# EAGLE design PGTN022_euclidean_logic (EAGLE 9.6.0)
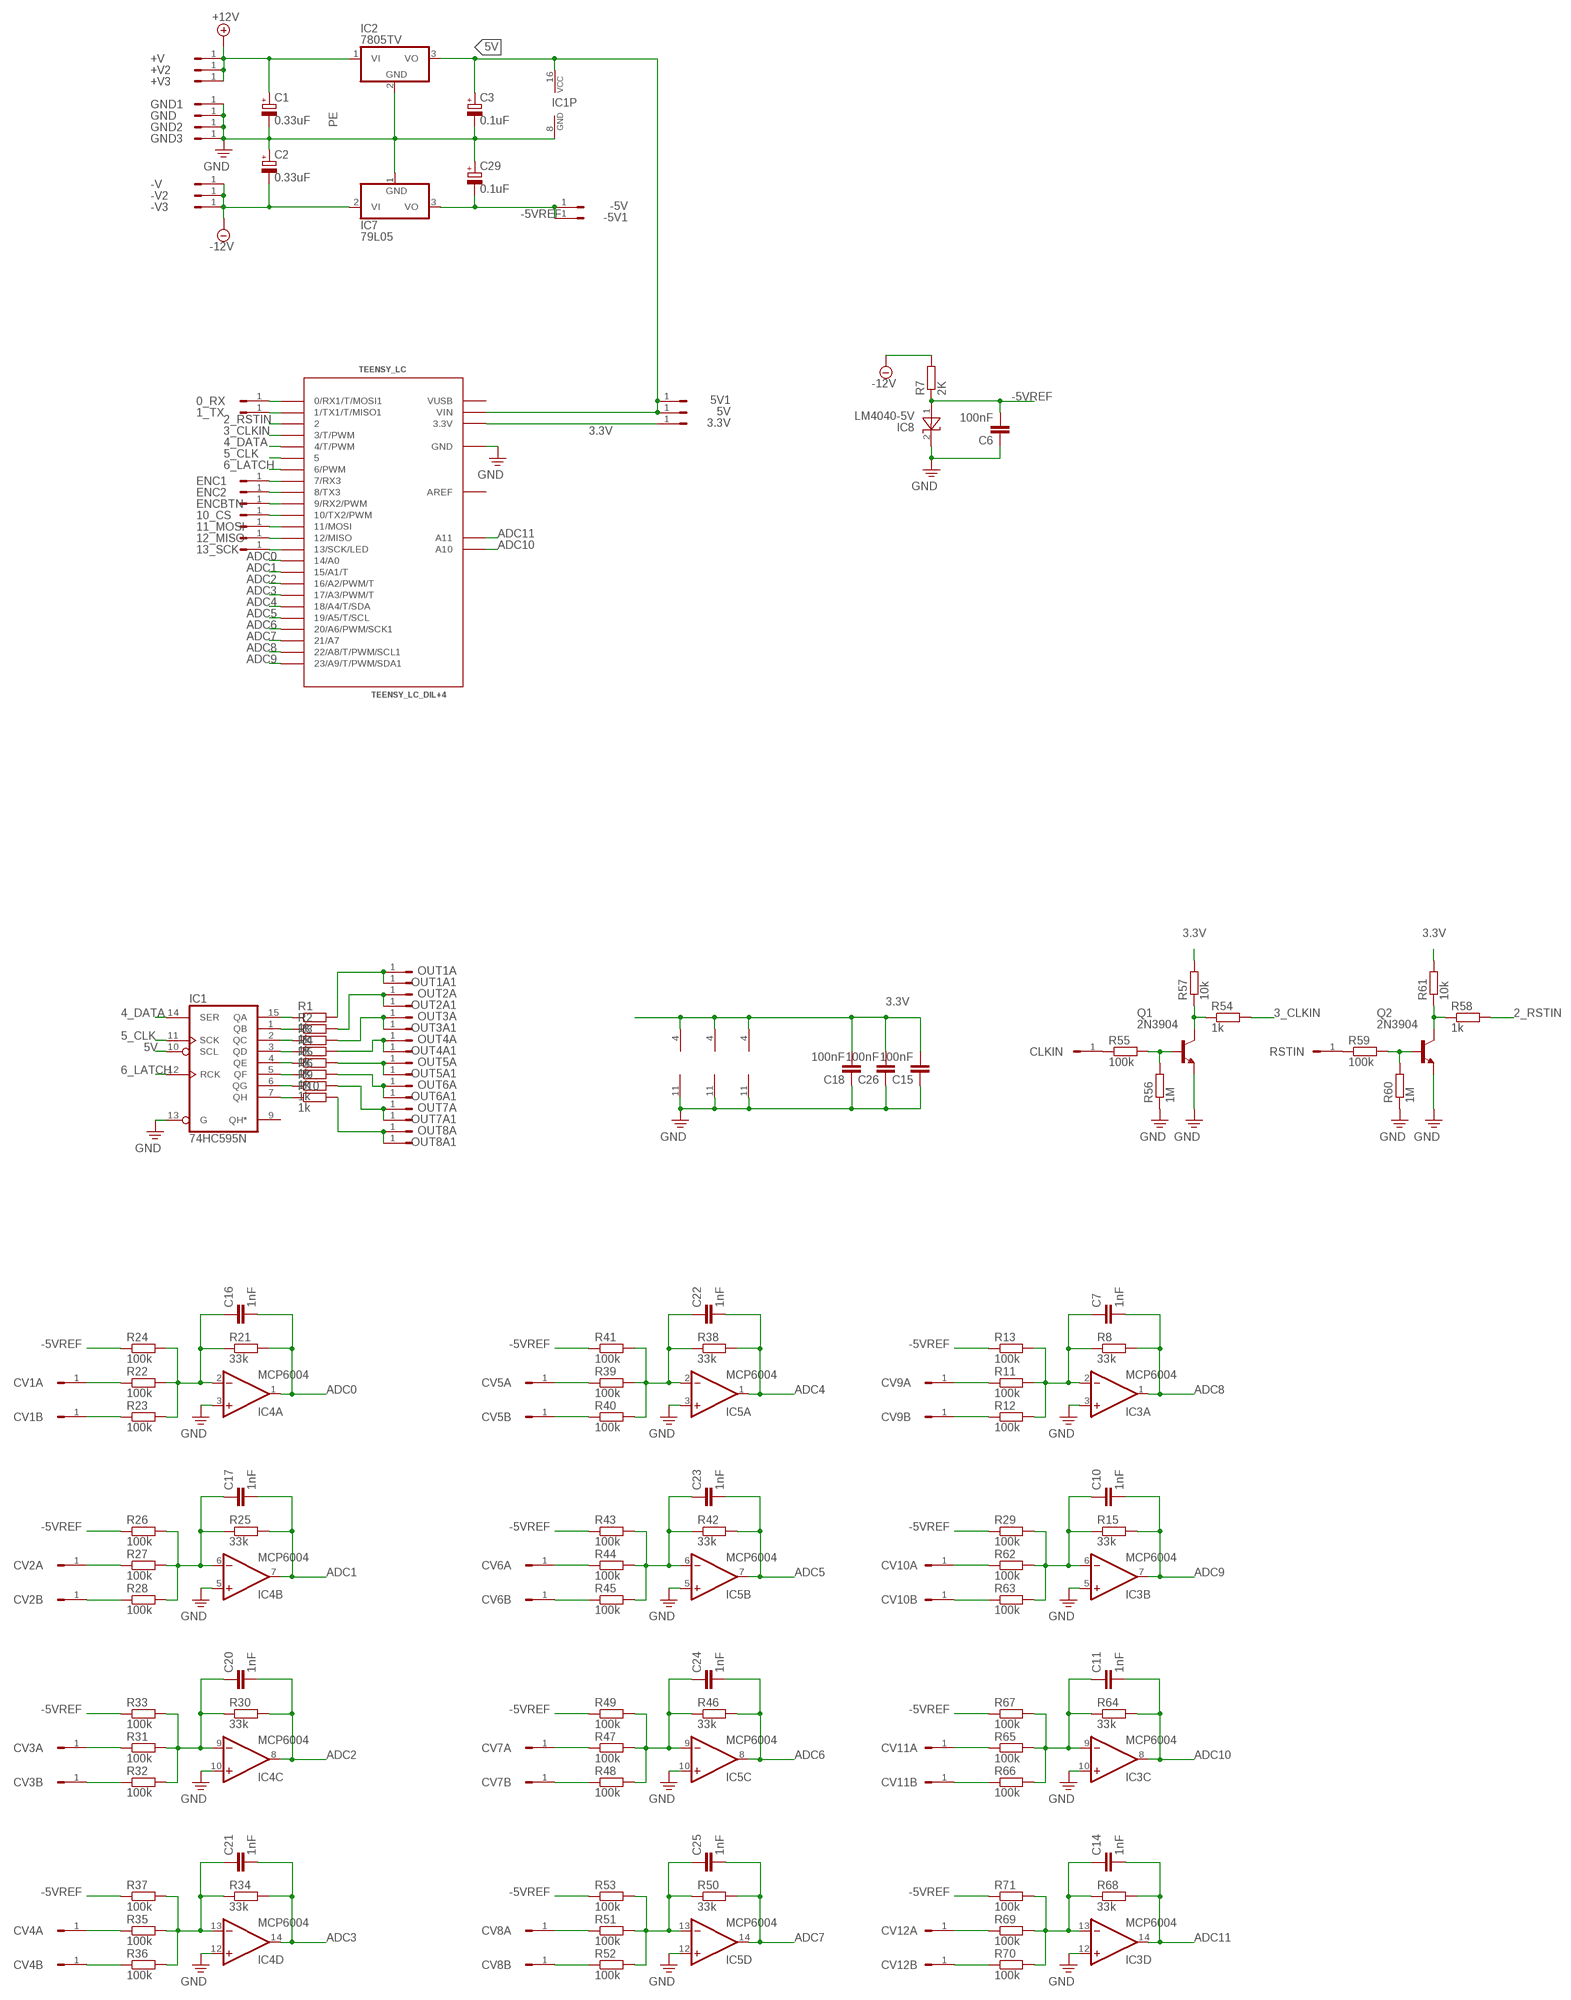
[diagram p0: schematic, sheet 1]

## Parts
0_RX  HEADER/MALE/01  [HEADER/MALE/01]
1_TX  HEADER/MALE/01  [HEADER/MALE/01]
3.3V  HEADER/MALE/01  [HEADER/MALE/01]
5V  HEADER/MALE/01  [HEADER/MALE/01]
5V1  HEADER/MALE/01  [HEADER/MALE/01]
10_CS  HEADER/MALE/01  [HEADER/MALE/01]
11_MOSI  HEADER/MALE/01  [HEADER/MALE/01]
12_MISO  HEADER/MALE/01  [HEADER/MALE/01]
13_SCK  HEADER/MALE/01  [HEADER/MALE/01]
+V  HEADER/MALE/01  [HEADER/MALE/01]
+V2  HEADER/MALE/01  [HEADER/MALE/01]
+V3  HEADER/MALE/01  [HEADER/MALE/01]
-5V  HEADER/MALE/01  [HEADER/MALE/01]
-5V1  HEADER/MALE/01  [HEADER/MALE/01]
-V  HEADER/MALE/01  [HEADER/MALE/01]
-V2  HEADER/MALE/01  [HEADER/MALE/01]
-V3  HEADER/MALE/01  [HEADER/MALE/01]
C1  0.33uF  CAPACITOR/POLARIZEDE2.5-6  [E2,5-6]
C2  0.33uF  CAPACITOR/POLARIZEDE2.5-6  [E2,5-6]
C3  0.1uF  CAPACITOR/POLARIZEDE2.5-6  [E2,5-6]
C6  100nF  CAPACITORCERAMICDISC/5  [CERAMICDISC/5]
C7  1nF  CAPACITORCERAMICDISC/5  [CERAMICDISC/5]
C10  1nF  CAPACITORCERAMICDISC/5  [CERAMICDISC/5]
C11  1nF  CAPACITORCERAMICDISC/5  [CERAMICDISC/5]
C14  1nF  CAPACITORCERAMICDISC/5  [CERAMICDISC/5]
C15  100nF  CAPACITORCERAMICDISC/5  [CERAMICDISC/5]
C16  1nF  CAPACITORCERAMICDISC/5  [CERAMICDISC/5]
C17  1nF  CAPACITORCERAMICDISC/5  [CERAMICDISC/5]
C18  100nF  CAPACITORCERAMICDISC/5  [CERAMICDISC/5]
C20  1nF  CAPACITORCERAMICDISC/5  [CERAMICDISC/5]
C21  1nF  CAPACITORCERAMICDISC/5  [CERAMICDISC/5]
C22  1nF  CAPACITORCERAMICDISC/5  [CERAMICDISC/5]
C23  1nF  CAPACITORCERAMICDISC/5  [CERAMICDISC/5]
C24  1nF  CAPACITORCERAMICDISC/5  [CERAMICDISC/5]
C25  1nF  CAPACITORCERAMICDISC/5  [CERAMICDISC/5]
C26  100nF  CAPACITORCERAMICDISC/5  [CERAMICDISC/5]
C29  0.1uF  CAPACITOR/POLARIZEDE2.5-6  [E2,5-6]
CLKIN  HEADER/MALE/01  [HEADER/MALE/01]
CV1A  HEADER/MALE/01  [HEADER/MALE/01]
CV1B  HEADER/MALE/01  [HEADER/MALE/01]
CV2A  HEADER/MALE/01  [HEADER/MALE/01]
CV2B  HEADER/MALE/01  [HEADER/MALE/01]
CV3A  HEADER/MALE/01  [HEADER/MALE/01]
CV3B  HEADER/MALE/01  [HEADER/MALE/01]
CV4A  HEADER/MALE/01  [HEADER/MALE/01]
CV4B  HEADER/MALE/01  [HEADER/MALE/01]
CV5A  HEADER/MALE/01  [HEADER/MALE/01]
CV5B  HEADER/MALE/01  [HEADER/MALE/01]
CV6A  HEADER/MALE/01  [HEADER/MALE/01]
CV6B  HEADER/MALE/01  [HEADER/MALE/01]
CV7A  HEADER/MALE/01  [HEADER/MALE/01]
CV7B  HEADER/MALE/01  [HEADER/MALE/01]
CV8A  HEADER/MALE/01  [HEADER/MALE/01]
CV8B  HEADER/MALE/01  [HEADER/MALE/01]
CV9A  HEADER/MALE/01  [HEADER/MALE/01]
CV9B  HEADER/MALE/01  [HEADER/MALE/01]
CV10A  HEADER/MALE/01  [HEADER/MALE/01]
CV10B  HEADER/MALE/01  [HEADER/MALE/01]
CV11A  HEADER/MALE/01  [HEADER/MALE/01]
CV11B  HEADER/MALE/01  [HEADER/MALE/01]
CV12A  HEADER/MALE/01  [HEADER/MALE/01]
CV12B  HEADER/MALE/01  [HEADER/MALE/01]
ENC1  HEADER/MALE/01  [HEADER/MALE/01]
ENC2  HEADER/MALE/01  [HEADER/MALE/01]
ENCBTN  HEADER/MALE/01  [HEADER/MALE/01]
GND  HEADER/MALE/01  [HEADER/MALE/01]
GND1  HEADER/MALE/01  [HEADER/MALE/01]
GND2  HEADER/MALE/01  [HEADER/MALE/01]
GND3  HEADER/MALE/01  [HEADER/MALE/01]
IC1  74HC595N  [DIL16]
IC2  7805TV  [TO220V]
IC3  MCP6004  TL074P  [DIL14]
IC4  MCP6004  TL074P  [DIL14]
IC5  MCP6004  TL074P  [DIL14]
IC7  79L05  79L05Z  [TO92]
IC8  LM4040-5V  LM4040  [TO92]
OUT1A  HEADER/MALE/01  [HEADER/MALE/01]
OUT1A1  HEADER/MALE/01  [HEADER/MALE/01]
OUT2A  HEADER/MALE/01  [HEADER/MALE/01]
OUT2A1  HEADER/MALE/01  [HEADER/MALE/01]
OUT3A  HEADER/MALE/01  [HEADER/MALE/01]
OUT3A1  HEADER/MALE/01  [HEADER/MALE/01]
OUT4A  HEADER/MALE/01  [HEADER/MALE/01]
OUT4A1  HEADER/MALE/01  [HEADER/MALE/01]
OUT5A  HEADER/MALE/01  [HEADER/MALE/01]
OUT5A1  HEADER/MALE/01  [HEADER/MALE/01]
OUT6A  HEADER/MALE/01  [HEADER/MALE/01]
OUT6A1  HEADER/MALE/01  [HEADER/MALE/01]
OUT7A  HEADER/MALE/01  [HEADER/MALE/01]
OUT7A1  HEADER/MALE/01  [HEADER/MALE/01]
OUT8A  HEADER/MALE/01  [HEADER/MALE/01]
OUT8A1  HEADER/MALE/01  [HEADER/MALE/01]
Q1  2N3904  [TO92]
Q2  2N3904  [TO92]
R1  1k  RESISTORRESISTOR/UPRIGHT/7.5  [RESISTOR/7.5]
R2  1k  RESISTORRESISTOR/UPRIGHT/7.5  [RESISTOR/7.5]
R3  1k  RESISTORRESISTOR/UPRIGHT/7.5  [RESISTOR/7.5]
R4  1k  RESISTORRESISTOR/UPRIGHT/7.5  [RESISTOR/7.5]
R5  1k  RESISTORRESISTOR/UPRIGHT/7.5  [RESISTOR/7.5]
R6  1k  RESISTORRESISTOR/UPRIGHT/7.5  [RESISTOR/7.5]
R7  2K  RESISTORRESISTOR/UPRIGHT/7.5  [RESISTOR/7.5]
R8  33k  RESISTORRESISTOR/UPRIGHT/7.5  [RESISTOR/7.5]
R9  1k  RESISTORRESISTOR/UPRIGHT/7.5  [RESISTOR/7.5]
R10  1k  RESISTORRESISTOR/UPRIGHT/7.5  [RESISTOR/7.5]
R11  100k  RESISTORRESISTOR/UPRIGHT/7.5  [RESISTOR/7.5]
R12  100k  RESISTORRESISTOR/UPRIGHT/7.5  [RESISTOR/7.5]
R13  100k  RESISTORRESISTOR/UPRIGHT/7.5  [RESISTOR/7.5]
R15  33k  RESISTORRESISTOR/UPRIGHT/7.5  [RESISTOR/7.5]
R21  33k  RESISTORRESISTOR/UPRIGHT/7.5  [RESISTOR/7.5]
R22  100k  RESISTORRESISTOR/UPRIGHT/7.5  [RESISTOR/7.5]
R23  100k  RESISTORRESISTOR/UPRIGHT/7.5  [RESISTOR/7.5]
R24  100k  RESISTORRESISTOR/UPRIGHT/7.5  [RESISTOR/7.5]
R25  33k  RESISTORRESISTOR/UPRIGHT/7.5  [RESISTOR/7.5]
R26  100k  RESISTORRESISTOR/UPRIGHT/7.5  [RESISTOR/7.5]
R27  100k  RESISTORRESISTOR/UPRIGHT/7.5  [RESISTOR/7.5]
R28  100k  RESISTORRESISTOR/UPRIGHT/7.5  [RESISTOR/7.5]
R29  100k  RESISTORRESISTOR/UPRIGHT/7.5  [RESISTOR/7.5]
R30  33k  RESISTORRESISTOR/UPRIGHT/7.5  [RESISTOR/7.5]
R31  100k  RESISTORRESISTOR/UPRIGHT/7.5  [RESISTOR/7.5]
R32  100k  RESISTORRESISTOR/UPRIGHT/7.5  [RESISTOR/7.5]
R33  100k  RESISTORRESISTOR/UPRIGHT/7.5  [RESISTOR/7.5]
R34  33k  RESISTORRESISTOR/UPRIGHT/7.5  [RESISTOR/7.5]
R35  100k  RESISTORRESISTOR/UPRIGHT/7.5  [RESISTOR/7.5]
R36  100k  RESISTORRESISTOR/UPRIGHT/7.5  [RESISTOR/7.5]
R37  100k  RESISTORRESISTOR/UPRIGHT/7.5  [RESISTOR/7.5]
R38  33k  RESISTORRESISTOR/UPRIGHT/7.5  [RESISTOR/7.5]
R39  100k  RESISTORRESISTOR/UPRIGHT/7.5  [RESISTOR/7.5]
R40  100k  RESISTORRESISTOR/UPRIGHT/7.5  [RESISTOR/7.5]
R41  100k  RESISTORRESISTOR/UPRIGHT/7.5  [RESISTOR/7.5]
R42  33k  RESISTORRESISTOR/UPRIGHT/7.5  [RESISTOR/7.5]
R43  100k  RESISTORRESISTOR/UPRIGHT/7.5  [RESISTOR/7.5]
R44  100k  RESISTORRESISTOR/UPRIGHT/7.5  [RESISTOR/7.5]
R45  100k  RESISTORRESISTOR/UPRIGHT/7.5  [RESISTOR/7.5]
R46  33k  RESISTORRESISTOR/UPRIGHT/7.5  [RESISTOR/7.5]
R47  100k  RESISTORRESISTOR/UPRIGHT/7.5  [RESISTOR/7.5]
R48  100k  RESISTORRESISTOR/UPRIGHT/7.5  [RESISTOR/7.5]
R49  100k  RESISTORRESISTOR/UPRIGHT/7.5  [RESISTOR/7.5]
R50  33k  RESISTORRESISTOR/UPRIGHT/7.5  [RESISTOR/7.5]
R51  100k  RESISTORRESISTOR/UPRIGHT/7.5  [RESISTOR/7.5]
R52  100k  RESISTORRESISTOR/UPRIGHT/7.5  [RESISTOR/7.5]
R53  100k  RESISTORRESISTOR/UPRIGHT/7.5  [RESISTOR/7.5]
R54  1k  RESISTORRESISTOR/UPRIGHT/7.5  [RESISTOR/7.5]
R55  100k  RESISTORRESISTOR/UPRIGHT/7.5  [RESISTOR/7.5]
R56  1M  RESISTORRESISTOR/UPRIGHT/7.5  [RESISTOR/7.5]
R57  10k  RESISTORRESISTOR/UPRIGHT/7.5  [RESISTOR/7.5]
R58  1k  RESISTORRESISTOR/UPRIGHT/7.5  [RESISTOR/7.5]
R59  100k  RESISTORRESISTOR/UPRIGHT/7.5  [RESISTOR/7.5]
R60  1M  RESISTORRESISTOR/UPRIGHT/7.5  [RESISTOR/7.5]
R61  10k  RESISTORRESISTOR/UPRIGHT/7.5  [RESISTOR/7.5]
R62  100k  RESISTORRESISTOR/UPRIGHT/7.5  [RESISTOR/7.5]
R63  100k  RESISTORRESISTOR/UPRIGHT/7.5  [RESISTOR/7.5]
R64  33k  RESISTORRESISTOR/UPRIGHT/7.5  [RESISTOR/7.5]
R65  100k  RESISTORRESISTOR/UPRIGHT/7.5  [RESISTOR/7.5]
R66  100k  RESISTORRESISTOR/UPRIGHT/7.5  [RESISTOR/7.5]
R67  100k  RESISTORRESISTOR/UPRIGHT/7.5  [RESISTOR/7.5]
R68  33k  RESISTORRESISTOR/UPRIGHT/7.5  [RESISTOR/7.5]
R69  100k  RESISTORRESISTOR/UPRIGHT/7.5  [RESISTOR/7.5]
R70  100k  RESISTORRESISTOR/UPRIGHT/7.5  [RESISTOR/7.5]
R71  100k  RESISTORRESISTOR/UPRIGHT/7.5  [RESISTOR/7.5]
RSTIN  HEADER/MALE/01  [HEADER/MALE/01]
TEENSY_LC  TEENSY_LC_DIL+4  [TEENSY_3.0-3.2&LC_DIL+4]

## Nets
2_RSTIN: R58.2 TEENSY_LC.2
3.3V: 3.3V.1 C15.2 C18.2 C26.2 IC3.4(P:V+) IC4.4(P:V+) IC5.4(P:V+) R57.2 R61.2 TEENSY_LC.3.3V
3_CLKIN: R54.2 TEENSY_LC.3(3/T/PWM)
4_DATA: IC1.14(SER) TEENSY_LC.4(4/T/PWM)
5_CLK: IC1.11(SCK) TEENSY_LC.5
5V: 5V1.1 5V.1 C3.+ IC1.10(SCL) IC1.16(VCC) IC2.3(VO) TEENSY_LC.VIN
6_LATCH: IC1.12(RCK) TEENSY_LC.6(6/PWM)
+12V: +V2.1 +V3.1 +V.1 C1.+ IC2.1(VI)
-5VREF: -5V1.1 -5V.1 C6.2 C29.- IC7.3(VO) IC8.1(A) R7.1 R13.1 R24.1 R26.1 R29.1 R33.1 R37.1 R41.1 R43.1 R49.1 R53.1 R67.1 R71.1
-12V: -V2.1 -V3.1 -V.1 C2.- IC7.2(VI) R7.2
ADC0: C16.2 IC4.1(A:OUT) R21.2 TEENSY_LC.14/A0
ADC1: C17.2 IC4.7(B:OUT) R25.2 TEENSY_LC.15/A1(15/A1/T)
ADC2: C20.2 IC4.8(C:OUT) R30.2 TEENSY_LC.16/A2(16/A2/PWM/T)
ADC3: C21.2 IC4.14(D:OUT) R34.2 TEENSY_LC.17/A3(17/A3/PWM/T)
ADC4: C22.2 IC5.1(A:OUT) R38.2 TEENSY_LC.18/A4(18/A4/T/SDA)
ADC5: C23.2 IC5.7(B:OUT) R42.2 TEENSY_LC.19/A5(19/A5/T/SCL)
ADC6: C24.2 IC5.8(C:OUT) R46.2 TEENSY_LC.20/A6(20/A6/PWM/SCK1)
ADC7: C25.2 IC5.14(D:OUT) R50.2 TEENSY_LC.21/A7
ADC8: C7.2 IC3.1(A:OUT) R8.2 TEENSY_LC.22/A8(22/A8/T/PWM/SCL1)
ADC9: C10.2 IC3.7(B:OUT) R15.2 TEENSY_LC.23/A9(23/A9/T/PWM/SDA1)
ADC10: C11.2 IC3.8(C:OUT) R64.2 TEENSY_LC.A10
ADC11: C14.2 IC3.14(D:OUT) R68.2 TEENSY_LC.A11
N$1: CV2A.1 R27.1
N$2: IC1.15(QA) R1.1
N$3: OUT1A1.1 OUT1A.1 R1.2
N$4: IC1.1(QB) R2.1
N$5: IC1.2(QC) R3.1
N$6: IC1.3(QD) R4.1
N$7: IC1.4(QE) R5.1
N$8: C7.1 IC3.2(A:-IN) R8.1 R11.2 R12.2 R13.2
N$9: IC1.5(QF) R6.1
N$10: IC1.6(QG) R9.1
N$11: IC1.7(QH) R10.1
N$12: OUT8A1.1 OUT8A.1 R10.2
N$13: CV9B.1 R12.1
N$14: CV9A.1 R11.1
N$15: OUT2A1.1 OUT2A.1 R2.2
N$16: C10.1 IC3.6(B:-IN) R15.1 R29.2 R62.2 R63.2
N$17: OUT3A1.1 OUT3A.1 R3.2
N$18: CV10A.1 R62.1
N$19: CV10B.1 R63.1
N$20: OUT4A1.1 OUT4A.1 R4.2
N$21: OUT5A1.1 OUT5A.1 R5.2
N$22: CV1A.1 R22.1
N$24: C16.1 IC4.2(A:-IN) R21.1 R22.2 R23.2 R24.2
N$25: R59.1 RSTIN.1
N$26: CV2B.1 R28.1
N$27: CV1B.1 R23.1
N$28: OUT6A1.1 OUT6A.1 R6.2
N$29: C17.1 IC4.6(B:-IN) R25.1 R26.2 R27.2 R28.2
N$30: C21.1 IC4.13(D:-IN) R34.1 R35.2 R36.2 R37.2
N$31: CV4A.1 R35.1
N$32: CV4B.1 R36.1
N$33: OUT7A1.1 OUT7A.1 R9.2
N$34: CV3B.1 R32.1
N$35: CV3A.1 R31.1
N$36: C20.1 IC4.9(C:-IN) R30.1 R31.2 R32.2 R33.2
N$37: 12_MISO.1 TEENSY_LC.12(12/MISO)
N$38: C22.1 IC5.2(A:-IN) R38.1 R39.2 R40.2 R41.2
N$39: 0_RX.1 TEENSY_LC.0(0/RX1/T/MOSI1)
N$40: CV5B.1 R40.1
N$41: CV5A.1 R39.1
N$42: 1_TX.1 TEENSY_LC.1(1/TX1/T/MISO1)
N$43: C23.1 IC5.6(B:-IN) R42.1 R43.2 R44.2 R45.2
N$44: CV6A.1 R44.1
N$45: CV6B.1 R45.1
N$46: C25.1 IC5.13(D:-IN) R50.1 R51.2 R52.2 R53.2
N$47: ENC1.1 TEENSY_LC.7(7/RX3)
N$48: CV8A.1 R51.1
N$49: CV8B.1 R52.1
N$50: CV7B.1 R48.1
N$51: CV7A.1 R47.1
N$52: C24.1 IC5.9(C:-IN) R46.1 R47.2 R48.2 R49.2
N$53: ENC2.1 TEENSY_LC.8(8/TX3)
N$54: CLKIN.1 R55.1
N$55: Q1.2(B) R55.2 R56.2
N$56: Q1.1(C) R54.1 R57.1
N$57: C14.1 IC3.13(D:-IN) R68.1 R69.2 R70.2 R71.2
N$58: Q2.2(B) R59.2 R60.2
N$59: Q2.1(C) R58.1 R61.1
N$60: CV12A.1 R69.1
N$61: ENCBTN.1 TEENSY_LC.9(9/RX2/PWM)
N$62: 10_CS.1 TEENSY_LC.10(10/TX2/PWM)
N$63: 11_MOSI.1 TEENSY_LC.11(11/MOSI)
N$64: 13_SCK.1 TEENSY_LC.13(13/SCK/LED)
N$68: CV12B.1 R70.1
N$69: CV11B.1 R66.1
N$70: CV11A.1 R65.1
N$71: C11.1 IC3.9(C:-IN) R64.1 R65.2 R66.2 R67.2
PE: C1.- C2.+ C3.- C6.1 C15.1 C18.1 C26.1 C29.+ GND1.1 GND2.1 GND3.1 GND.1 IC1.8(GND) IC1.13(G) IC2.2(GND) IC3.3(A:+IN) IC3.5(B:+IN) IC3.10(C:+IN) IC3.11(P:V-) IC3.12(D:+IN) IC4.3(A:+IN) IC4.5(B:+IN) IC4.10(C:+IN) IC4.11(P:V-) IC4.12(D:+IN) IC5.3(A:+IN) IC5.5(B:+IN) IC5.10(C:+IN) IC5.11(P:V-) IC5.12(D:+IN) IC7.1(GND) IC8.2(C) Q1.3(E) Q2.3(E) R56.1 R60.1 TEENSY_LC.AGND(GND) TEENSY_LC.GND ; supply symbol labelled GND
Unconnected: IC1.9(QH*)

## Power pins joined to a net without a drawn wire
AREF: TEENSY_LC.AREF
VUSB: TEENSY_LC.VUSB

## Library data of the parts
0_RX 1_TX 3.3V 5V 5V1 10_CS 11_MOSI 12_MISO 13_SCK +V +V2 +V3 -5V -5V1 -V -V2 -V3 CLKIN CV1A CV1B CV2A CV2B CV3A CV3B CV4A CV4B CV5A CV5B CV6A CV6B CV7A CV7B CV8A CV8B CV9A CV9B CV10A CV10B CV11A CV11B CV12A CV12B ENC1 ENC2 ENCBTN GND GND1-GND3 OUT1A OUT1A1 OUT2A OUT2A1 OUT3A OUT3A1 OUT4A OUT4A1 OUT5A OUT5A1 OUT6A OUT6A1 OUT7A OUT7A1 OUT8A OUT8A1 RSTIN = connectors:HEADER/MALE/01; SPICEPREFIX: X
C1-C3 C29 = capacitors:CAPACITOR/POLARIZED: POLARIZED CAPACITOR, European symbol; SPICEPREFIX: C
C6 C7 C10 C11 C14-C18 C20-C26 = capacitors:CAPACITOR: CAPACITOR, European symbol
IC1 = ic_digital:74*595: 8-bit SHIFT REGISTER, output latch
IC2 = ic_voltage_reg:78*: Positive VOLTAGE REGULATOR Source: http://cache.national.com/ds/LM/LM78L05.pdf http://www.fairchildsemi.com/ds/LM/LM7805.pdf
IC3-IC5 = ic_analogue:TL074: OP AMP
IC7 = linear:79*: Negative VOLTAGE REGULATOR
IC8 = ic_voltage_reg:LM4040
Q1 Q2 = transistors:2N3904: NPN Transistor
R1-R13 R15 R21-R71 = resistors:RESISTOR: RESISTOR, European symbol
TEENSY_LC = Teensy_3_and_LC_Series_Boards_v1.4:TEENSY_LC_DIL+4: DIL package with 4 pins on the inside broken out.

## Board
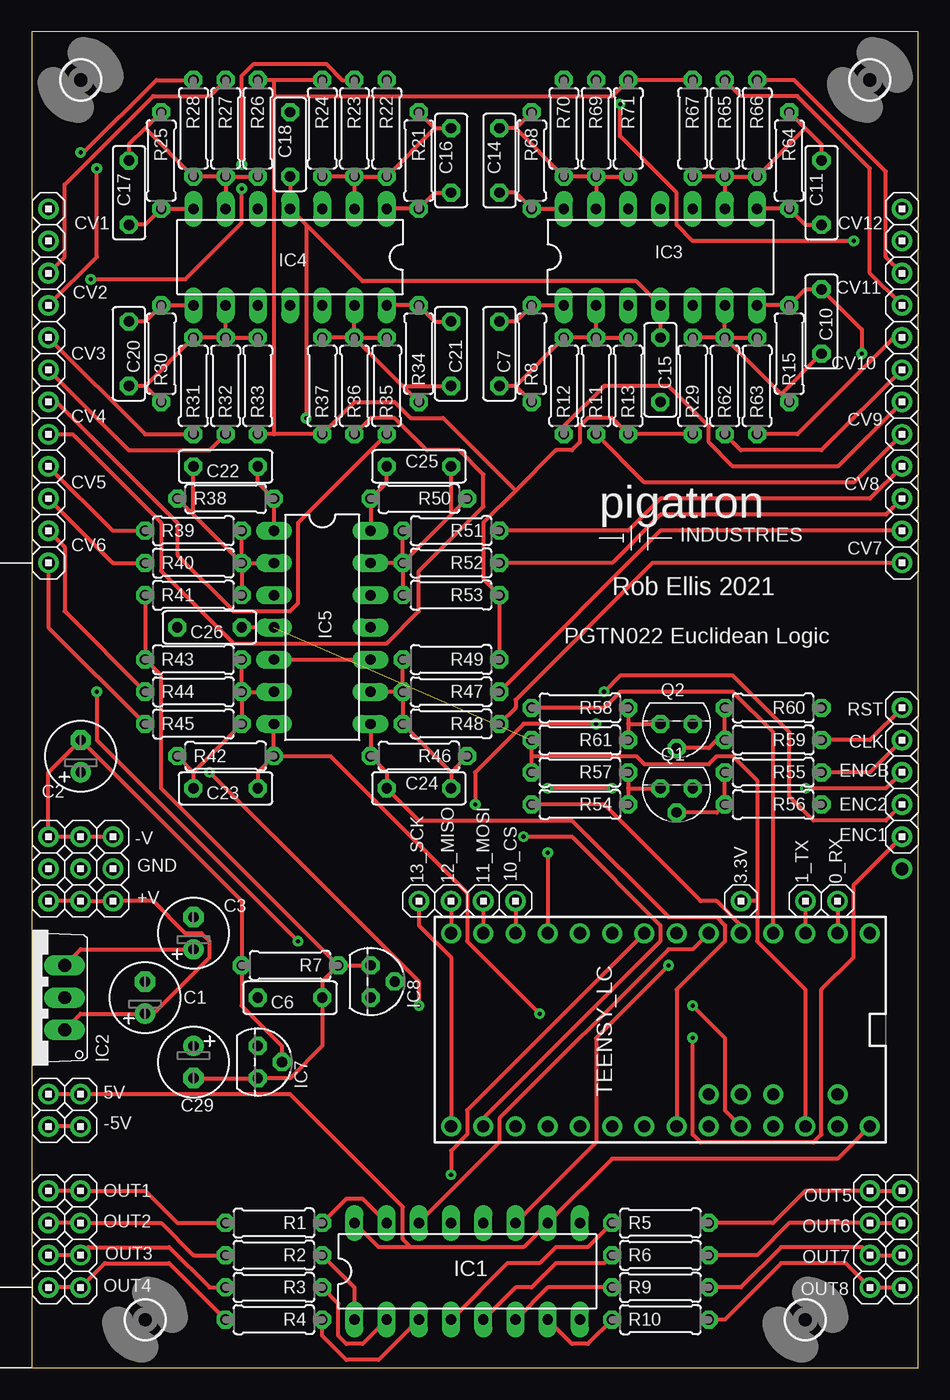
[diagram p1: board, top side]
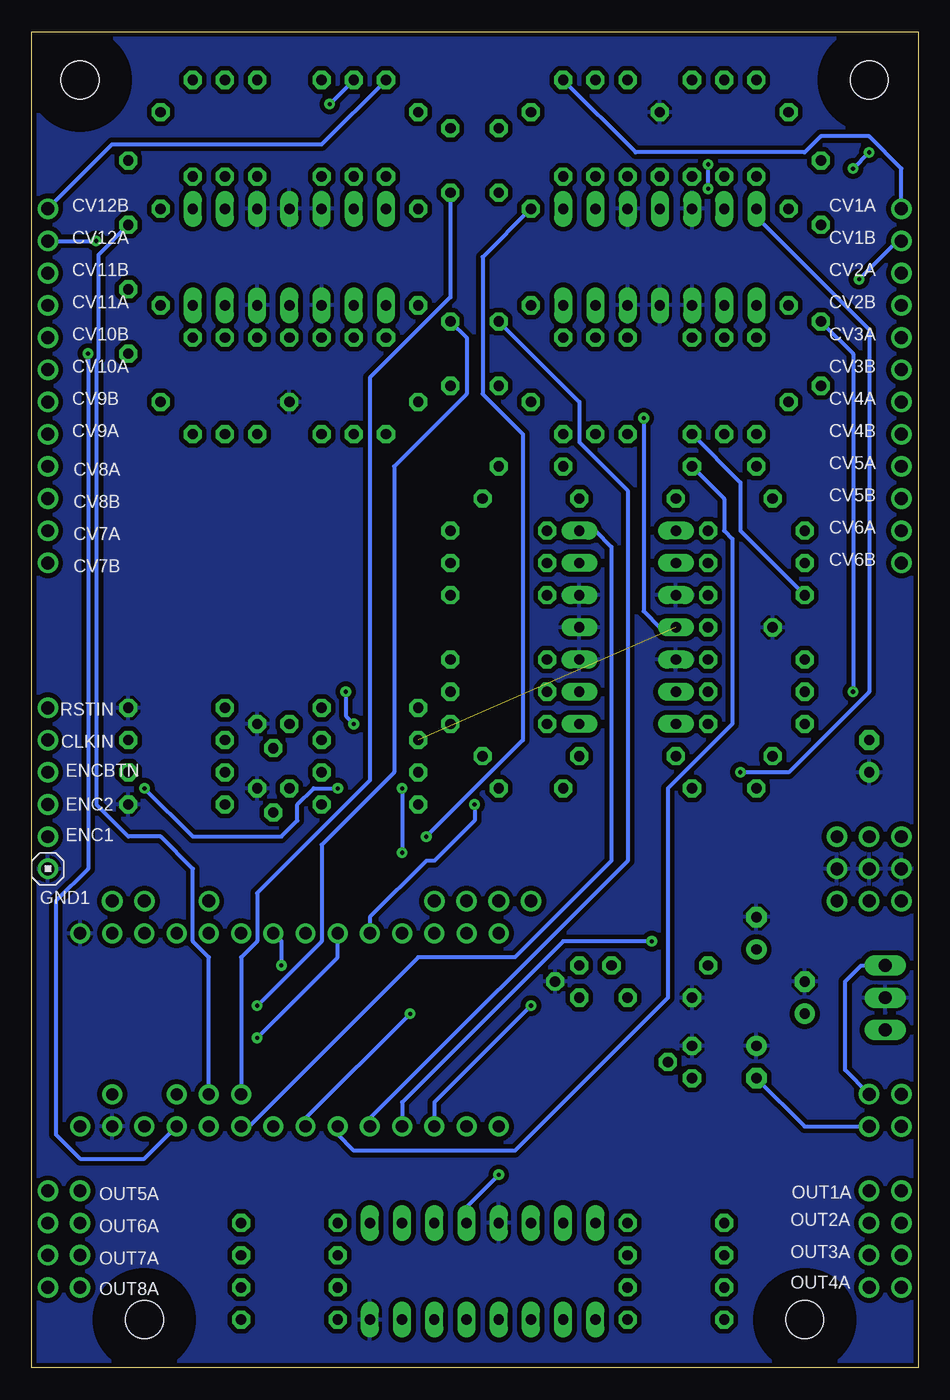
[diagram p2: board, bottom side, seen from below]

Size 69.9 x 105.4 mm. Coordinates in mm from the lower left corner, seen from the top.
Outline: 69.9,105.4 0,105.4 0,0 69.9,0 69.9,105.4
Copper layers (1*16): Top 0.0356mm / dielectric 1.5011mm / Bottom 0.0356mm
Design rules "pigatron": minimum track width 12mil, minimum drill 13mil, track to track 15mil, track to pad 10mil, pad to pad 10mil, via to via 10mil, smd to smd 6mil, copper to edge 15mil, drill to drill 10mil, minimum pad ring 12mil, minimum via ring 10mil, stop-mask expansion 4mil, vias tented up to drill 0mil, thermal gap 10mil

### Footprints (pad centres in the part's own frame; a part is rotated, then mirrored left to right if it is on the bottom)
HEADER/MALE/01 = drill 1.016: 1 0,0
E2,5-6 = drill 0.813 pad 1.6: + -1.27,0 | drill 0.813 pad 1.6 octagon: - 1.27,0
CERAMICDISC/5 = drill 0.813 octagon: 1 -2.54,0; 2 2.54,0
DIL16 = drill 0.813 long: 1 -8.89,-3.81; 2 -6.35,-3.81; 3 -3.81,-3.81; 4 -1.27,-3.81; 5 1.27,-3.81; 6 3.81,-3.81; 7 6.35,-3.81; 8 8.89,-3.81; 9 8.89,3.81; 10 6.35,3.81; 11 3.81,3.81; 12 1.27,3.81; 13 -1.27,3.81; 14 -3.81,3.81; 15 -6.35,3.81; 16 -8.89,3.81
TO220V = drill 1.016 long: 1 -2.54,-2.54; 2 0,-2.54; 3 2.54,-2.54
DIL14 = drill 0.813 long: 1 -7.62,-3.81; 2 -5.08,-3.81; 3 -2.54,-3.81; 4 0,-3.81; 5 2.54,-3.81; 6 5.08,-3.81; 7 7.62,-3.81; 8 7.62,3.81; 9 5.08,3.81; 10 2.54,3.81; 11 0,3.81; 12 -2.54,3.81; 13 -5.08,3.81; 14 -7.62,3.81
TO92 = drill 0.813 octagon: 1 -1.27,0; 2 0,1.905; 3 1.27,0
TO92' = drill 0.813 octagon: 1 1.27,0; 2 0,1.905; 3 -1.27,0
RESISTOR/7.5 = drill 0.813 octagon: 1 -3.81,0; 2 3.81,0
TEENSY_3.0-3.2&LC_DIL+4 = drill 0.965: 0 -7.62,13.97; 1 -7.62,11.43; 2 -7.62,8.89; 3 -7.62,6.35; 3.3V 7.62,11.43; 4 -7.62,3.81; 5 -7.62,1.27; 6 -7.62,-1.27; 7 -7.62,-3.81; 8 -7.62,-6.35; 9 -7.62,-8.89; 10 -7.62,-11.43; 11 -7.62,-13.97; 12 -7.62,-16.51; 13 7.62,-16.51; 14/A0 7.62,-13.97; 15/A1 7.62,-11.43; 16/A2 7.62,-8.89; 17/A3 7.62,-6.35; 18/A4 7.62,-3.81; 19/A5 7.62,-1.27; 20/A6 7.62,1.27; 21/A7 7.62,3.81; 22/A8 7.62,6.35; 23/A9 7.62,8.89; A10 5.08,6.35; A11 5.08,3.81; AGND 7.62,13.97; AREF 5.08,8.89; GND -7.62,16.51; VIN 7.62,16.51; VUSB 5.08,13.97
STANDOFF/3.0 = hole 3: 0,0

### Placement (x,y rotation side)
0_RX  63.55,36.82 90 top
1_TX  61.01,36.82 90 top
3.3V  55.93,36.82 90 top
5V  1.32,21.58 180 top
5V1  3.86,21.58 0 top
10_CS  38.15,36.82 90 top
11_MOSI  35.61,36.82 90 top
12_MISO  33.07,36.82 90 top
13_SCK  30.53,36.82 90 top
+V  6.4,36.82 0 top
+V2  3.86,36.82 180 top
+V3  1.32,36.82 180 top
-5V  1.32,19.04 0 top
-5V1  3.86,19.04 0 top
-V  6.4,41.9 0 top
-V2  3.86,41.9 180 top
-V3  1.32,41.9 180 top
C1  8.94,29.2 90 top
C2  3.86,48.25 90 top
C3  12.75,34.28 90 top
C6  20.37,29.2 0 top
C7  36.88,80 90 top
C10  62.28,82.54 90 top
C11  62.28,92.7 270 top
C14  36.88,95.24 270 top
C15  49.58,78.73 90 top
C16  33.07,95.24 270 top
C17  7.67,92.7 270 top
C18  20.37,96.51 270 top
C20  7.67,80 90 top
C21  33.07,80 90 top
C22  15.29,71.11 0 top
C23  15.29,45.71 0 top
C24  30.53,45.71 180 top
C25  30.53,71.11 180 top
C26  14.02,58.41 0 top
C29  12.75,24.12 270 top
CLKIN  68.63,49.52 180 top
CV1A  1.32,91.43 0 top
CV1B  1.32,88.89 0 top
CV2A  1.32,86.35 0 top
CV2B  1.32,83.81 0 top
CV3A  1.32,81.27 0 top
CV3B  1.32,78.73 0 top
CV4A  1.32,76.19 0 top
CV4B  1.32,73.65 0 top
CV5A  1.32,71.11 0 top
CV5B  1.32,68.57 0 top
CV6A  1.32,66.03 0 top
CV6B  1.32,63.49 0 top
CV7A  68.63,66.03 180 top
CV7B  68.63,63.49 180 top
CV8A  68.63,71.11 180 top
CV8B  68.63,68.57 180 top
CV9A  68.63,73.65 0 top
CV9B  68.63,76.19 0 top
CV10A  68.63,78.73 0 top
CV10B  68.63,81.27 0 top
CV11A  68.63,83.81 0 top
CV11B  68.63,86.35 0 top
CV12A  68.63,88.89 0 top
CV12B  68.63,91.43 0 top
ENC1  68.63,41.9 180 top
ENC2  68.63,44.44 180 top
ENCBTN  68.63,46.98 180 top
GND  6.4,39.36 0 top
GND1  68.63,39.36 0 bottom
GND2  1.32,39.36 180 top
GND3  3.86,39.36 180 top
IC1  34.34,7.61 0 top
IC2  0.05,29.2 90 top
IC3  49.58,87.62 0 top
IC4  20.37,87.62 180 top
IC5  22.91,58.41 270 top
IC7  17.83,24.12 270 top
IC8  26.72,30.47 270 top
OUT1A  1.32,13.96 0 top
OUT1A1  3.86,13.96 0 top
OUT2A  1.32,11.42 0 top
OUT2A1  3.86,11.42 0 top
OUT3A  1.32,8.88 0 top
OUT3A1  3.86,8.88 0 top
OUT4A  1.32,6.34 0 top
OUT4A1  3.86,6.34 0 top
OUT5A  68.63,13.96 180 top
OUT5A1  66.09,13.96 0 top
OUT6A  68.63,11.42 180 top
OUT6A1  66.09,11.42 0 top
OUT7A  68.63,8.88 180 top
OUT7A1  66.09,8.88 0 top
OUT8A  68.63,6.34 180 top
OUT8A1  66.09,6.34 0 top
Q1  2N3904  [TO92']  50.85,45.71 180 top
Q2  2N3904  [TO92']  50.85,50.79 180 top
R1  19.1,11.42 180 top
R2  19.1,8.88 180 top
R3  19.1,6.34 180 top
R4  19.1,3.8 180 top
R5  49.58,11.42 0 top
R6  49.58,8.88 0 top
R7  20.37,31.74 180 top
R8  39.42,80 90 top
R9  49.58,6.34 0 top
R10  49.58,3.8 0 top
R11  44.5,77.46 90 top
R12  41.96,77.46 90 top
R13  47.04,77.46 90 top
R15  59.74,80 90 top
R21  30.53,95.24 270 top
R22  27.99,97.78 270 top
R23  25.45,97.78 270 top
R24  22.91,97.78 270 top
R25  10.21,95.24 270 top
R26  17.83,97.78 270 top
R27  15.29,97.78 270 top
R28  12.75,97.78 270 top
R29  52.12,77.46 90 top
R30  10.21,80 90 top
R31  12.75,77.46 90 top
R32  15.29,77.46 90 top
R33  17.83,77.46 90 top
R34  30.53,80 90 top
R35  27.99,77.46 90 top
R36  25.45,77.46 90 top
R37  22.91,77.46 90 top
R38  15.29,68.57 0 top
R39  12.75,66.03 0 top
R40  12.75,63.49 0 top
R41  12.75,60.95 0 top
R42  15.29,48.25 0 top
R43  12.75,55.87 0 top
R44  12.75,53.33 0 top
R45  12.75,50.79 0 top
R46  30.53,48.25 180 top
R47  33.07,53.33 180 top
R48  33.07,50.79 180 top
R49  33.07,55.87 180 top
R50  30.53,68.57 180 top
R51  33.07,66.03 180 top
R52  33.07,63.49 180 top
R53  33.07,60.95 180 top
R54  43.23,44.44 180 top
R55  58.47,46.98 180 top
R56  58.47,44.44 180 top
R57  43.23,46.98 180 top
R58  43.23,52.06 180 top
R59  58.47,49.52 180 top
R60  58.47,52.06 180 top
R61  43.23,49.52 180 top
R62  54.66,77.46 90 top
R63  57.2,77.46 90 top
R64  59.74,95.24 270 top
R65  54.66,97.78 270 top
R66  57.2,97.78 270 top
R67  52.12,97.78 270 top
R68  39.42,95.24 270 top
R69  44.5,97.78 270 top
R70  41.96,97.78 270 top
R71  47.04,97.78 270 top
RSTIN  68.63,52.06 180 top
TEENSY_LC  49.58,26.66 270 top
U$1  [PIGATRON-LOGO]  53.65,67.05 0 top
U$2  [STANDOFF/3.0]  3.86,101.59 0 top
U$3  [STANDOFF/3.0]  66.09,101.59 0 top
U$4  [STANDOFF/3.0]  8.94,3.8 0 top
U$5  [STANDOFF/3.0]  61.01,3.8 0 top

### Tracks (layer width: path | path; a pad name or v marks a point on that pad's centre or on a via)
2_RSTIN
  Top 0.305: R58.2 45.14,52.06 46.41,53.33 55.3,53.33 58.47,50.16 TEENSY_LC.2
3.3V  (via drill 0.33)  (1 unrouted)
  Top 0.305: R57.2 39.42,48.25 | 39.42,48.25 R61.2 | TEENSY_LC.3.3V 61.01,29.83 57.2,33.65 57.2,36.82 | 57.2,36.82 57.2,46.34 55.3,48.25 54.03,48.25 53.39,47.62 48.31,47.62 47.68,48.25 39.42,48.25 | 57.2,36.82 3.3V.1 | IC5.4 C26.2 | C18.2 IC4.4 21.64,90.16 | C15.2 IC3.4 47.68,85.71 26.09,85.71 21.64,90.16 | 21.64,90.16 v21.64,74.92
  Bottom 0.305: IC5.4 20.37,58.41 21.64,59.68 v21.64,74.92
3_CLKIN
  Top 0.305: R54.2 45.14,44.44 52.76,36.82 54.03,36.82 55.93,34.91 TEENSY_LC.3
4_DATA
  Top 0.305: IC1.14 36.88,17.77 36.88,19.67 50.22,33.01 52.12,33.01 TEENSY_LC.4
5_CLK  (via drill 0.33)
  Top 0.305: IC1.11 44.5,17.77 44.5,26.02 v50.22,31.74
  Bottom 0.305: v50.22,31.74 50.22,33.65 TEENSY_LC.5
5V
  Top 0.305: 5V.1 5V1.1 20.37,21.58 29.26,12.69 29.26,10.15 29.9,9.52 | TEENSY_LC.VIN 63.55,16.5 45.77,16.5 IC1.10 38.79,9.52 29.9,9.52 | C3.+ 3.86,33.01 IC2.3 | IC1.16 27.36,9.52 29.9,9.52
  Bottom 0.305: IC2.3 4.5,31.74 5.77,30.47 5.77,23.48 5V1.1
6_LATCH  (via drill 0.33)
  Top 0.305: v33.07,15.23 33.07,17.13 34.34,18.4 34.34,20.31 TEENSY_LC.6
  Bottom 0.305: IC1.12 35.61,12.69 v33.07,15.23
+12V
  Top 0.305: +V3.1 +V2.1 +V.1 9.58,36.82 12.12,34.28 13.39,34.28 14.02,33.65 14.02,32.38 9.58,27.93 C1.+ 3.86,27.93 IC2.1
-5VREF
  Top 0.305: R67.1 R71.1 45.77,100.32 19.1,100.32 | 19.1,73.65 R37.1 25.45,76.19 28.63,76.19 29.9,74.92 32.44,74.92 38.15,69.2 | 19.1,73.65 R33.1 | R24.1 19.1,101.59 | 19.1,101.59 R26.1 | 19.1,101.59 19.1,100.32 | 19.1,100.32 19.1,73.65 | C29.- IC7.3 20.37,22.85 22.91,25.39 C6.2 22.91,30.47 R7.1 | R29.1 R13.1 45.77,74.92 43.87,74.92 43.23,74.28 43.23,73.02 42.6,72.38 41.33,72.38 38.15,69.2 | R49.1 R53.1 35.61,62.22 35.61,66.66 38.15,69.2 | R41.1 R43.1 10.21,54.6 10.21,45.71 R7.1 | R7.1 IC8.1 | -5V1.1 -5V.1
  Bottom 0.305: -5V1.1 8.94,19.04 C29.- | R41.1 14.02,66.03 14.02,69.84 R33.1
-12V
  Top 0.305: IC7.2 19.74,25.39 16.56,28.56 R7.2 16.56,36.82 C2.- 1.32,46.98 -V3.1 -V2.1 -V.1
ADC0  (via drill 0.33)
  Top 0.305: IC4.1 R21.2 31.8,92.7 C16.2 | TEENSY_LC.14/A0 35.61,19.67 49.58,33.65 49.58,34.91 42.6,41.9 v38.79,41.9
  Bottom 0.305: v38.79,41.9 31.17,49.52 31.17,73.65 34.34,76.82 34.34,87.62 R21.2
ADC1  (via drill 0.33)
  Top 0.305: C17.2 8.94,90.16 R25.2 IC4.7 | v30.53,28.56 30.53,30.47 v14.02,46.98
  Bottom 0.305: TEENSY_LC.15/A1 38.15,20.94 v30.53,28.56 | v14.02,46.98 10.21,46.98 3.86,53.33 3.86,81.91 12.75,90.8 IC4.7
ADC2  (via drill 0.33)
  Top 0.305: C20.2 8.94,82.54 R30.2 IC4.8 | v21.01,33.65 5.13,49.52 v5.13,53.33
  Bottom 0.305: TEENSY_LC.16/A2 40.69,20.94 27.99,33.65 v21.01,33.65 | v5.13,53.33 5.13,80 C20.2
ADC3
  Top 0.305: IC4.14 R34.2 31.8,82.54 C21.2
  Bottom 0.305: TEENSY_LC.17/A3 43.23,19.67 22.91,40 22.91,69.2 26.72,73.02 26.72,76.19 C21.2
ADC4
  Top 0.305: IC5.1 R38.2 17.83,69.84 C22.2
  Bottom 0.305: TEENSY_LC.18/A4 45.77,18.4 44.5,17.13 31.8,17.13 19.74,29.2 19.74,45.71 14.66,50.79 14.66,65.39 15.29,66.03 15.29,68.57 C22.2
ADC5  (via drill 0.33)
  Top 0.305: C23.2 17.83,46.98 R42.2 | R42.2 IC5.7 | v40.06,27.93 34.34,33.65 34.34,37.46 23.55,48.25 R42.2
  Bottom 0.305: TEENSY_LC.19/A5 48.31,19.67 v40.06,27.93
ADC6
  Top 0.305: IC5.8 R46.2 27.99,46.98 C24.2 30.53,43.17 42.6,43.17 50.22,35.55 54.03,35.55 54.66,34.91 54.66,33.65 50.85,29.83 TEENSY_LC.20/A6
ADC7
  Top 0.305: IC5.14 R50.2 27.99,69.84 C25.2
  Bottom 0.305: TEENSY_LC.21/A7 52.76,19.04 39.42,32.38 31.8,32.38 24.18,40 24.18,64.76 25.45,66.03 IC5.14
ADC8  (via drill 0.33)
  Top 0.305: C7.2 38.15,82.54 R8.2 IC3.1 | TEENSY_LC.22/A8 54.66,20.31 54.66,26.02 v52.12,28.56
  Bottom 0.305: v52.12,28.56 47.04,33.65 47.04,41.27 41.33,46.98 41.33,71.11 35.61,76.82 35.61,81.27 C7.2
ADC9  (via drill 0.33)
  Top 0.305: IC3.7 R15.2 61.01,85.08 C10.2 65.46,81.91 v65.46,80
  Bottom 0.305: v65.46,80 65.46,39.36 68,36.82 68,18.4 66.09,16.5 61.01,16.5 TEENSY_LC.23/A9
ADC10
  Top 0.305: IC3.8 R64.2 61.01,90.16 C11.2
  Bottom 0.305: TEENSY_LC.A10 55.93,32.38 57.2,33.65 57.2,39.36 59.74,41.9 62.28,41.9 64.77,44.39 64.77,79.52 64.63,79.66 64.63,87.81 C11.2
ADC11
  Top 0.305: C14.2 38.15,92.7 R68.2 IC3.14
  Bottom 0.305: TEENSY_LC.A11 53.39,32.38 52.12,33.65 52.12,37.46 43.23,46.34 43.23,78.09 36.88,84.44 C14.2
N$1
  Top 0.305: R27.1 14.02,100.32 9.58,100.32 2.59,93.33 2.59,87.62 CV2A.1
N$2
  Top 0.305: R1.1 24.82,13.33 26.09,13.33 IC1.15
N$3
  Top 0.305: OUT1A.1 OUT1A1.1 8.94,13.96 11.48,11.42 R1.2
N$4
  Top 0.305: IC1.1 25.45,6.34 R2.1
N$5
  Top 0.305: R3.1 24.18,5.07 24.18,2.53 24.82,1.9 26.09,1.9 IC1.2
N$6
  Top 0.305: R4.1 22.91,2.53 24.82,0.62 27.36,0.62 IC1.3
N$7
  Top 0.305: IC1.4 37.52,8.25 40.06,8.25 41.33,9.52 43.87,9.52 R5.1
N$8
  Top 0.305: 38.15,77.46 C7.1 | R8.1 38.15,77.46 | R11.2 R12.2 38.15,77.46 | R11.2 IC3.2 | R11.2 R13.2
N$9
  Top 0.305: IC1.5 38.15,6.34 39.42,6.34 41.33,8.25 45.14,8.25 R6.1
N$10
  Top 0.305: IC1.6 40.69,6.34 R9.1
N$11
  Top 0.305: IC1.7 42.6,1.9 43.87,1.9 R10.1
N$12
  Top 0.305: OUT8A.1 OUT8A1.1 64.19,8.25 59.11,8.25 54.66,3.8 R10.2
N$13
  Top 0.305: R12.1 41.96,74.28 45.14,77.46 50.22,77.46 53.39,74.28 53.39,73.02 55.3,71.11 63.55,71.11 CV9B.1
N$14
  Top 0.305: R11.1 48.31,69.84 64.82,69.84 CV9A.1
N$15
  Top 0.305: OUT2A.1 OUT2A1.1 10.21,11.42 12.75,8.88 R2.2
N$16
  Top 0.305: R62.2 R29.2 | R62.2 R63.2 | R62.2 IC3.6 | R62.2 59.11,76.82 | 59.11,76.82 R15.1 | 59.11,76.82 C10.1
N$17
  Top 0.305: OUT3A.1 OUT3A1.1 4.5,9.52 10.85,9.52 14.02,6.34 R3.2
N$18
  Top 0.305: R62.1 55.93,72.38 62.28,72.38 CV10A.1
N$19
  Top 0.305: R63.1 60.38,73.65 68,81.27 CV10B.1
N$20
  Top 0.305: OUT4A.1 OUT4A1.1 5.77,8.25 10.85,8.25 R4.2
N$21
  Top 0.305: OUT5A.1 OUT5A1.1 61.01,13.96 58.47,11.42 R5.2
N$22
  Bottom 0.305: R22.1 22.28,95.88 8.94,95.88 7.67,97.14 3.86,97.14 1.32,94.6 CV1A.1
N$24
  Top 0.305: 31.8,97.78 C16.1 | R21.1 31.8,97.78 | R23.2 IC4.2 | R23.2 R24.2 | R23.2 R22.2 31.8,97.78
N$25
  Top 0.305: R59.1 66.09,49.52 RSTIN.1
N$26  (via drill 0.33)
  Top 0.305: R28.1 9.83,101.59 4.12,95.88 v3.86,95.88 | v5.13,94.6 5.13,87.62 CV2B.1
  Bottom 0.305: v5.13,94.6 v3.86,95.88
N$27  (via drill 0.33)
  Top 0.305: R23.1 24.5,101.59 23.23,102.86 17.51,102.86 16.56,101.91 v16.56,94.92 | v16.56,93.02 16.56,90.32 12.12,85.87 v4.66,85.87
  Bottom 0.305: v16.56,93.02 v16.56,94.92 | v4.66,85.87 1.64,88.89 CV1B.1
N$28
  Top 0.305: OUT6A.1 OUT6A1.1 59.74,11.42 57.2,8.88 R6.2
N$29
  Top 0.305: C17.1 7.67,96.51 8.94,97.78 | R25.1 8.94,97.78 | R27.2 R28.2 8.94,97.78 | R27.2 IC4.6 | R27.2 R26.2
N$30
  Top 0.305: R36.2 R37.2 | R36.2 R35.2 | R36.2 IC4.13 | R36.2 29.26,77.46 | 29.26,77.46 R34.1 | 29.26,77.46 C21.1
N$31
  Top 0.305: R35.1 21.01,66.66 21.01,60.32 20.37,59.68 15.93,59.68 11.48,64.12 11.48,66.66 1.96,76.19 CV4A.1
N$32
  Top 0.305: R36.1 26.72,74.92 28.63,74.92 31.17,72.38 33.71,72.38 35.61,70.47 35.61,67.93 30.53,62.86 30.53,59.68 27.99,57.14 15.93,57.14 10.21,62.86 10.21,66.66 3.23,73.65 CV4B.1
N$33
  Top 0.305: OUT7A.1 OUT7A1.1 65.46,9.52 59.11,9.52 55.93,6.34 R9.2
N$34
  Top 0.305: R32.1 14.02,72.38 7.67,72.38 CV3B.1
N$35
  Top 0.305: R31.1 8.94,73.65 CV3A.1
N$36
  Top 0.305: 8.94,77.46 C20.1 | R30.1 8.94,77.46 | R32.2 R31.2 8.94,77.46 | R32.2 R33.2 | R32.2 IC4.9
N$37
  Top 0.305: 12_MISO.1 TEENSY_LC.12
N$38
  Top 0.305: R40.2 R41.2 | R40.2 R39.2 | R40.2 IC5.2 | R40.2 12.75,67.3 | 12.75,67.3 R38.1 | 12.75,67.3 C22.1
N$39
  Top 0.305: 0_RX.1 TEENSY_LC.0
N$40
  Top 0.305: R40.1 6.4,63.49 CV5B.1
N$41
  Top 0.305: R39.1 6.4,66.03 CV5A.1
N$42
  Top 0.305: 1_TX.1 TEENSY_LC.1
N$43
  Top 0.305: 12.75,46.98 C23.1 | R42.1 12.75,46.98 | R44.2 R45.2 12.75,46.98 | R44.2 R43.2 | R44.2 IC5.6
N$44
  Top 0.305: R44.1 2.59,59.68 2.59,64.76 CV6A.1
N$45
  Top 0.305: R45.1 1.32,58.41 CV6B.1
N$46
  Top 0.305: R52.2 R53.2 | R52.2 IC5.13 | R52.2 R51.2 | R52.2 33.07,67.3 | 33.07,67.3 R50.1 | 33.07,67.3 C25.1
N$47  (via drill 0.33)
  Top 0.305: v52.12,26.02 52.12,18.4 52.76,17.77 61.65,17.77 62.28,18.4 62.28,29.83 64.82,32.38 64.82,38.09 ENC1.1
  Bottom 0.305: TEENSY_LC.7 45.77,32.38 v52.12,26.02
N$48
  Top 0.305: R51.1 47.04,66.03 49.58,68.57 66.09,68.57 CV8A.1
N$49
  Top 0.305: R52.1 45.77,63.49 49.58,67.3 67.36,67.3 CV8B.1
N$50
  Top 0.305: R48.1 38.15,52.06 38.15,52.7 48.95,63.49 CV7B.1
N$51
  Top 0.305: R47.1 49.58,66.03 CV7A.1
N$52
  Top 0.305: 33.07,46.98 C24.1 | R46.1 33.07,46.98 | R47.2 R48.2 33.07,46.98 | R47.2 IC5.9 | R47.2 R49.2
N$53  (via drill 0.33)
  Top 0.305: v34.98,44.44 34.98,46.98 38.79,50.79 v44.5,50.79 | v45.14,53.33 46.41,54.6 55.3,54.6 59.74,50.16 59.74,45.08 61.65,43.17 67.36,43.17 ENC2.1
  Bottom 0.305: TEENSY_LC.8 43.23,35.55 38.79,40 38.15,40 34.98,43.17 v34.98,44.44 | v44.5,50.79 45.14,51.43 v45.14,53.33
N$54
  Top 0.305: R55.1 66.09,46.98 CLKIN.1
N$55
  Top 0.305: Q1.2 54.03,43.8 R56.2 R55.2
N$56
  Top 0.305: R57.1 47.04,45.71 | 47.04,45.71 R54.1 | 47.04,45.71 Q1.1
N$57
  Top 0.305: 38.15,97.78 C14.1 | R68.1 38.15,97.78 | R69.2 IC3.13 | R69.2 R70.2 38.15,97.78 | R69.2 R71.2
N$58
  Top 0.305: Q2.2 53.39,48.89 54.03,49.52 R59.2 R60.2
N$59
  Top 0.305: R58.1 47.04,50.79 | 47.04,50.79 R61.1 | 47.04,50.79 Q2.1
N$60  (via drill 0.33)
  Top 0.305: v46.41,99.68 46.41,97.14 50.85,92.7 50.85,90.16 52.12,88.89 v64.82,88.89
  Bottom 0.305: v46.41,99.68 R69.1 | CV12A.1 v64.82,88.89
N$61  (via drill 0.33)
  Top 0.305: v40.69,40.63 TEENSY_LC.9 | v45.77,45.71 v40.69,45.71 | v61.01,45.71 67.36,45.71 ENCBTN.1
  Bottom 0.305: v40.69,45.71 v40.69,40.63 | v45.77,45.71 47.68,45.71 48.95,44.44 48.95,43.17 50.22,41.9 57.2,41.9 v61.01,45.71
N$62
  Top 0.305: 10_CS.1 TEENSY_LC.10
N$63
  Top 0.305: 11_MOSI.1 TEENSY_LC.11
N$64
  Top 0.305: TEENSY_LC.13 33.07,32.38 30.53,34.91 13_SCK.1
N$68
  Bottom 0.305: R70.1 47.04,96.51 63.55,96.51 CV12B.1
N$69
  Top 0.305: CV11B.1 67.36,87.62 67.36,94.36 60.13,101.59 R66.1
N$70
  Top 0.305: R65.1 55.93,100.32 60.38,100.32 66.09,94.6 66.09,86.35 CV11A.1
N$71
  Top 0.305: C11.1 62.28,96.51 61.01,97.78 | R64.1 61.01,97.78 | R65.2 R67.2 | R65.2 IC3.9 | R65.2 R66.2 61.01,97.78
PE
  Top 0.305: IC5.5 IC5.10
  pour Bottom: 69.9,-0.01 0.05,-0.01 0.05,105.4 69.9,105.4
  pour Bottom: 69.9,-0.01 0.05,-0.01 0.05,105.4 69.9,105.4

### Text on the board
tNames: CV1 | CV12 | CV11 | CV2 | CV3 | CV10 | CV4 | CV9 | CV5 | CV8 | CV6 | CV7 | Rob Ellis 2021 | PGTN022 Euclidean Logic | RST | CLK | ENCB | ENC2 | ENC1 | OUT1 | OUT5 | OUT2 | OUT6 | OUT3 | OUT7 | OUT4 | OUT8